# EAGLE design CCD-schematic (EAGLE 7.7.0)
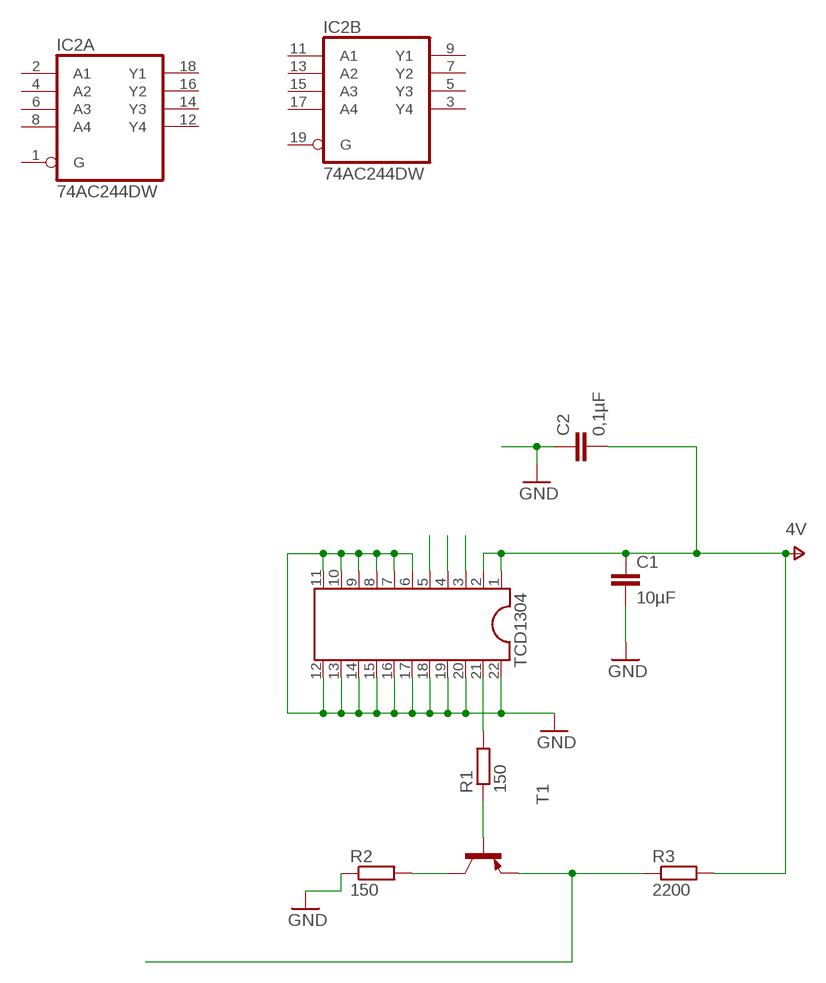
[diagram p0: schematic, sheet 1]

## Parts
C1  10µF  C0805  [0805]
C2  0,1µF  C0805  [0805]
IC2  74AC244DW  [SO20W]
R1  150  R0603  [0603]
R2  150  R0603  [0603]
R3  2200  R0603  [0603]
T1  -PNP-SOT23-EBC  [SOT23-EBC]
TCD1304  DIL22-4  [DIL22-4]

## Nets
GND: C1.2 C2.1 R2.1 TCD1304.6 TCD1304.7 TCD1304.8 TCD1304.9 TCD1304.10 TCD1304.11 TCD1304.12 TCD1304.13 TCD1304.14 TCD1304.15 TCD1304.16 TCD1304.17 TCD1304.18 TCD1304.19 TCD1304.20 TCD1304.22
N$1: R3.1 T1.E
N$2: R1.1 T1.B
N$3: R1.2 TCD1304.21
N$4: R2.2 T1.C
N$5: TCD1304.4
N$9: TCD1304.5
N$10: TCD1304.3
V+: C1.1 C2.2 R3.2 TCD1304.1 TCD1304.2 ; supply symbol labelled 4V
Unconnected: IC2.1(A:G) IC2.2(A:A1) IC2.3(B:Y4) IC2.4(A:A2) IC2.5(B:Y3) IC2.6(A:A3) IC2.7(B:Y2) IC2.8(A:A4) IC2.9(B:Y1) IC2.11(B:A1) IC2.12(A:Y4) IC2.13(B:A2) IC2.14(A:Y3) IC2.15(B:A3) IC2.16(A:Y2) IC2.17(B:A4) IC2.18(A:Y1) IC2.19(B:G)

## Power pins joined to a net without a drawn wire
GND: IC2.10(P:GND)
VCC: IC2.20(P:VCC)

## Library data of the parts
C1 C2 = smalsmd:C: Capacitor
IC2 = 74xx-eu:74*244: Octal BUFFER and LINE DRIVER, 3-state
R1-R3 = smalsmd:R
T1 = transistor-neu-to92:*-PNP-: PNP Transistror
TCD1304 = ic-package:DIL22: Dual In Line / Socket

## Board
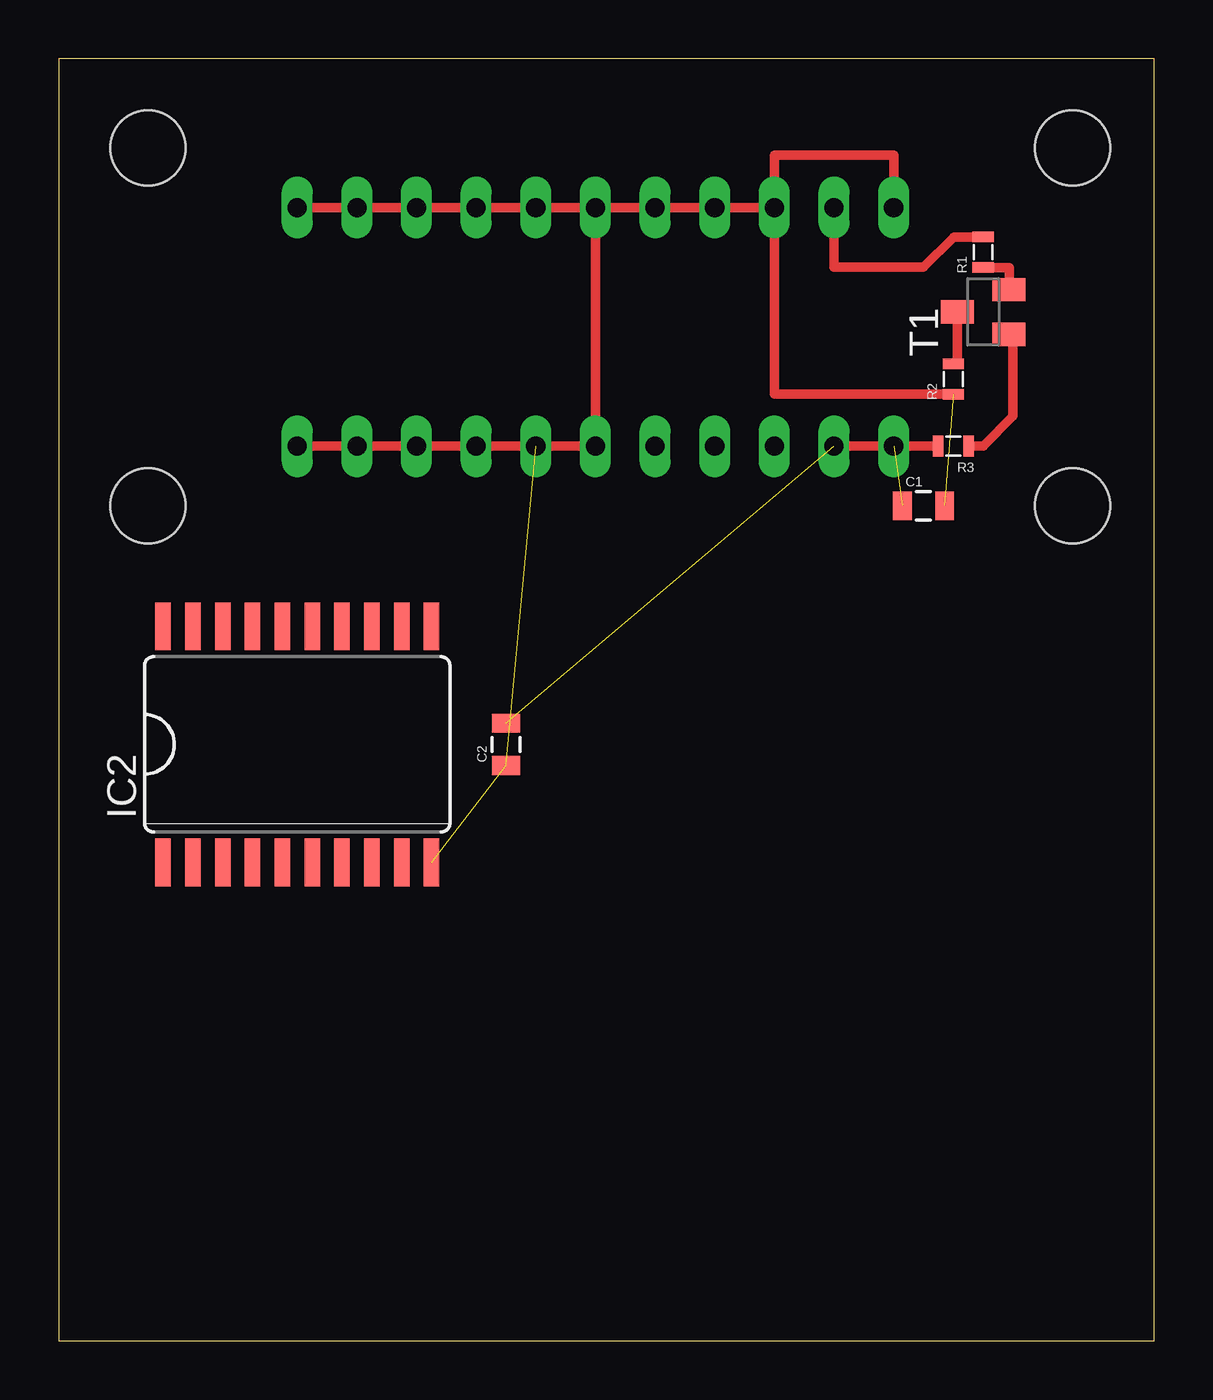
[diagram p1: board, top side]
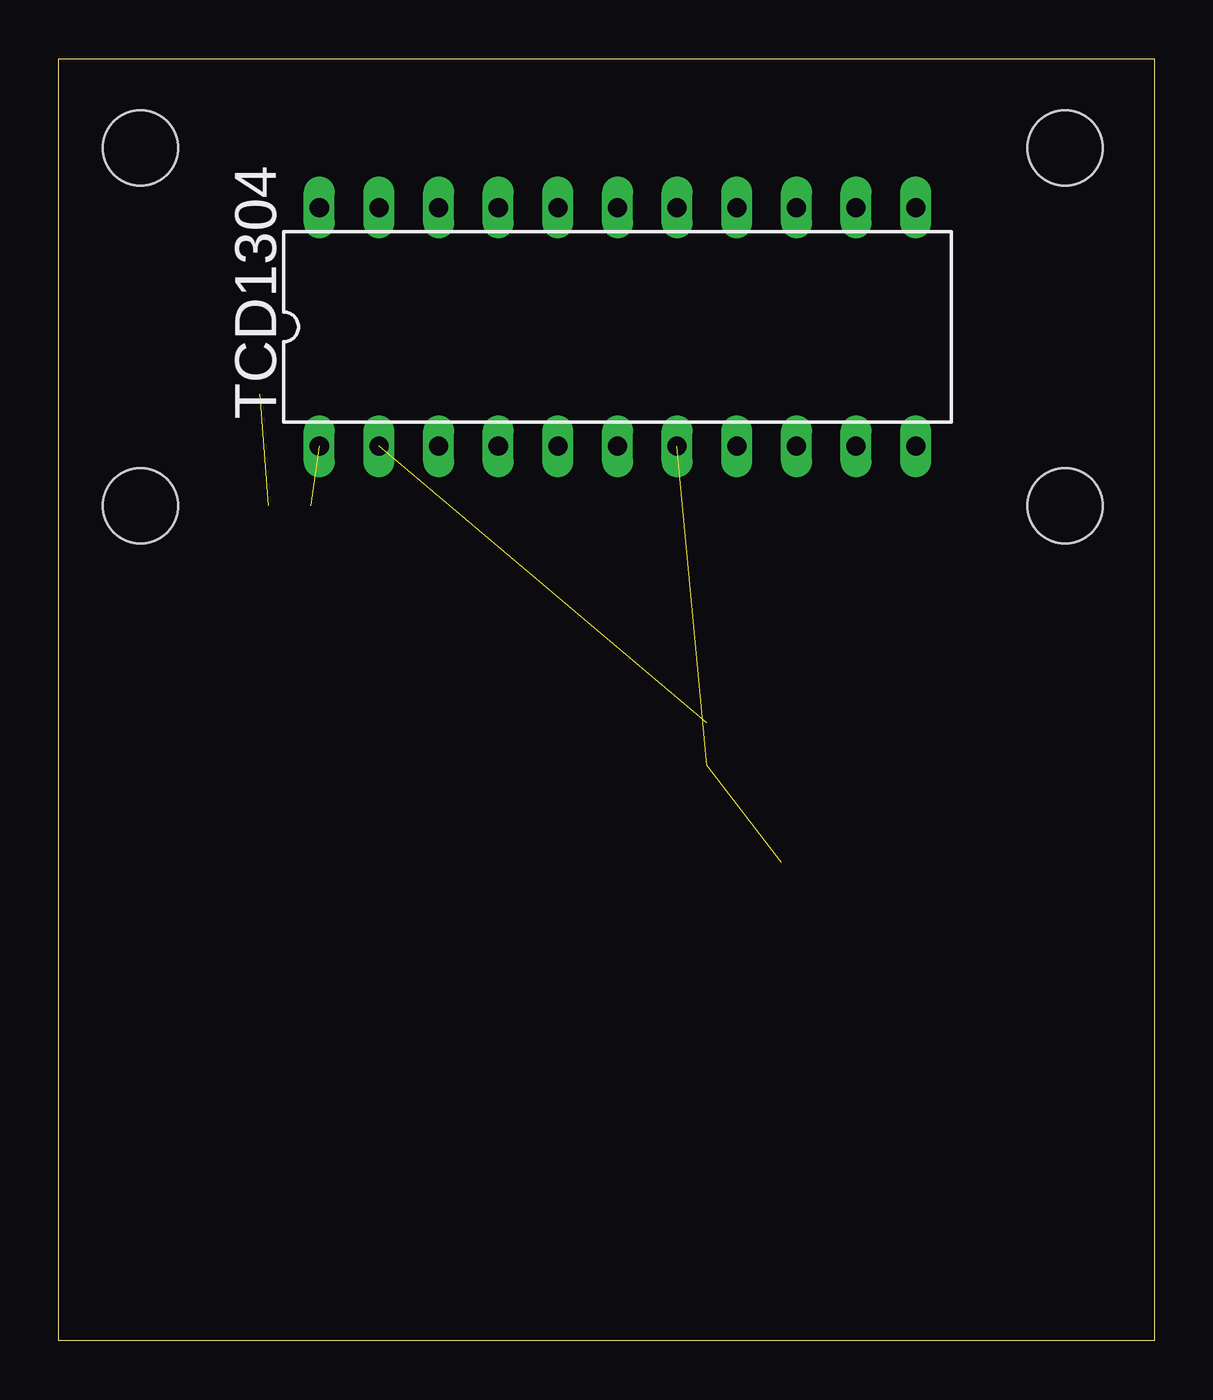
[diagram p2: board, bottom side, seen from below]

Size 46.66 x 54.6 mm. Coordinates in mm from the lower left corner, seen from the top.
Outline: 0,0 46.66,0 46.66,54.6 0,54.6 0,0
Copper layers (1*16): Top 0.035mm / dielectric 1.5mm / Bottom 0.035mm
Design rules "default *": minimum track width 10mil, minimum drill 24mil, track to track 8mil, track to pad 8mil, pad to pad 8mil, via to via 8mil, smd to smd 8mil, copper to edge 40mil, drill to drill 20mil, minimum pad ring 10mil, minimum via ring 8mil, stop-mask expansion 4mil, vias tented up to drill 0mil, thermal gap 10mil
Holes 3.2 mm at 3.81,50.8 43.18,50.8 3.81,35.56 43.18,35.56

### Footprints (pad centres in the part's own frame; a part is rotated, then mirrored left to right if it is on the bottom)
0805 = smd 0.8 x 1.2: 1 -0.9,0; 2 0.9,0
SO20W = smd 0.66 x 2.032: 1 -5.715,-5.029; 2 -4.445,-5.029; 3 -3.175,-5.029; 4 -1.905,-5.029; 5 -0.635,-5.029; 6 0.635,-5.029; 7 1.905,-5.029; 8 3.175,-5.029; 9 4.445,-5.029; 10 5.715,-5.029; 11 5.715,5.029; 12 4.445,5.029; 13 3.175,5.029; 14 1.905,5.029; 15 0.635,5.029; 16 -0.635,5.029; 17 -1.905,5.029; 18 -3.175,5.029; 19 -4.445,5.029; 20 -5.715,5.029
0603 = smd 0.45 x 0.9: 1 -0.65,0; 2 0.65,0
SOT23-EBC = smd 1 x 1.4: B 0.95,-1.1; C 0,1.1; E -0.95,-1.1
DIL22-4 = drill 0.813 long: 1 -12.7,-5.08; 2 -10.16,-5.08; 3 -7.62,-5.08; 4 -5.08,-5.08; 5 -2.54,-5.08; 6 0,-5.08; 7 2.54,-5.08; 8 5.08,-5.08; 9 7.62,-5.08; 10 10.16,-5.08; 11 12.7,-5.08; 12 12.7,5.08; 13 10.16,5.08; 14 7.62,5.08; 15 5.08,5.08; 16 2.54,5.08; 17 0,5.08; 18 -2.54,5.08; 19 -5.08,5.08; 20 -7.62,5.08; 21 -10.16,5.08; 22 -12.7,5.08

### Placement (x,y rotation side)
C1  36.83,35.56 0 top
C2  19.05,25.4 90 top
IC2  10.16,25.4 0 top
R1  39.37,46.35 90 top
R2  38.1,40.96 90 top
R3  38.1,38.1 180 top
T1  39.37,43.81 90 top
TCD1304  22.86,43.18 0 bottom

### Tracks (layer width: path | path; a pad name or v marks a point on that pad's centre or on a via)
GND  (3 unrouted)
  Top 0.406: TCD1304.20 30.48,50.48 35.56,50.48 TCD1304.22 | TCD1304.17 TCD1304.6 TCD1304.7 TCD1304.8 TCD1304.9 TCD1304.10 TCD1304.11 | TCD1304.12 TCD1304.13 TCD1304.14 TCD1304.15 TCD1304.16 TCD1304.17 | TCD1304.17 TCD1304.18 TCD1304.19 TCD1304.20 | R2.1 30.48,40.31 TCD1304.20
N$1
  Top 0.406: R3.1 39.37,38.1 40.64,39.37 40.64,42.7 T1.E
N$2
  Top 0.406: R1.1 40.48,45.7 T1.B
N$3
  Top 0.406: TCD1304.21 33.02,45.72 36.83,45.72 38.11,47 R1.2
N$4
  Top 0.406: R2.2 38.27,41.78 T1.C
V+  (2 unrouted)
  Top 0.406: TCD1304.2 TCD1304.1 R3.2